# EAGLE design mcu_brd (EAGLE 7.7.0)
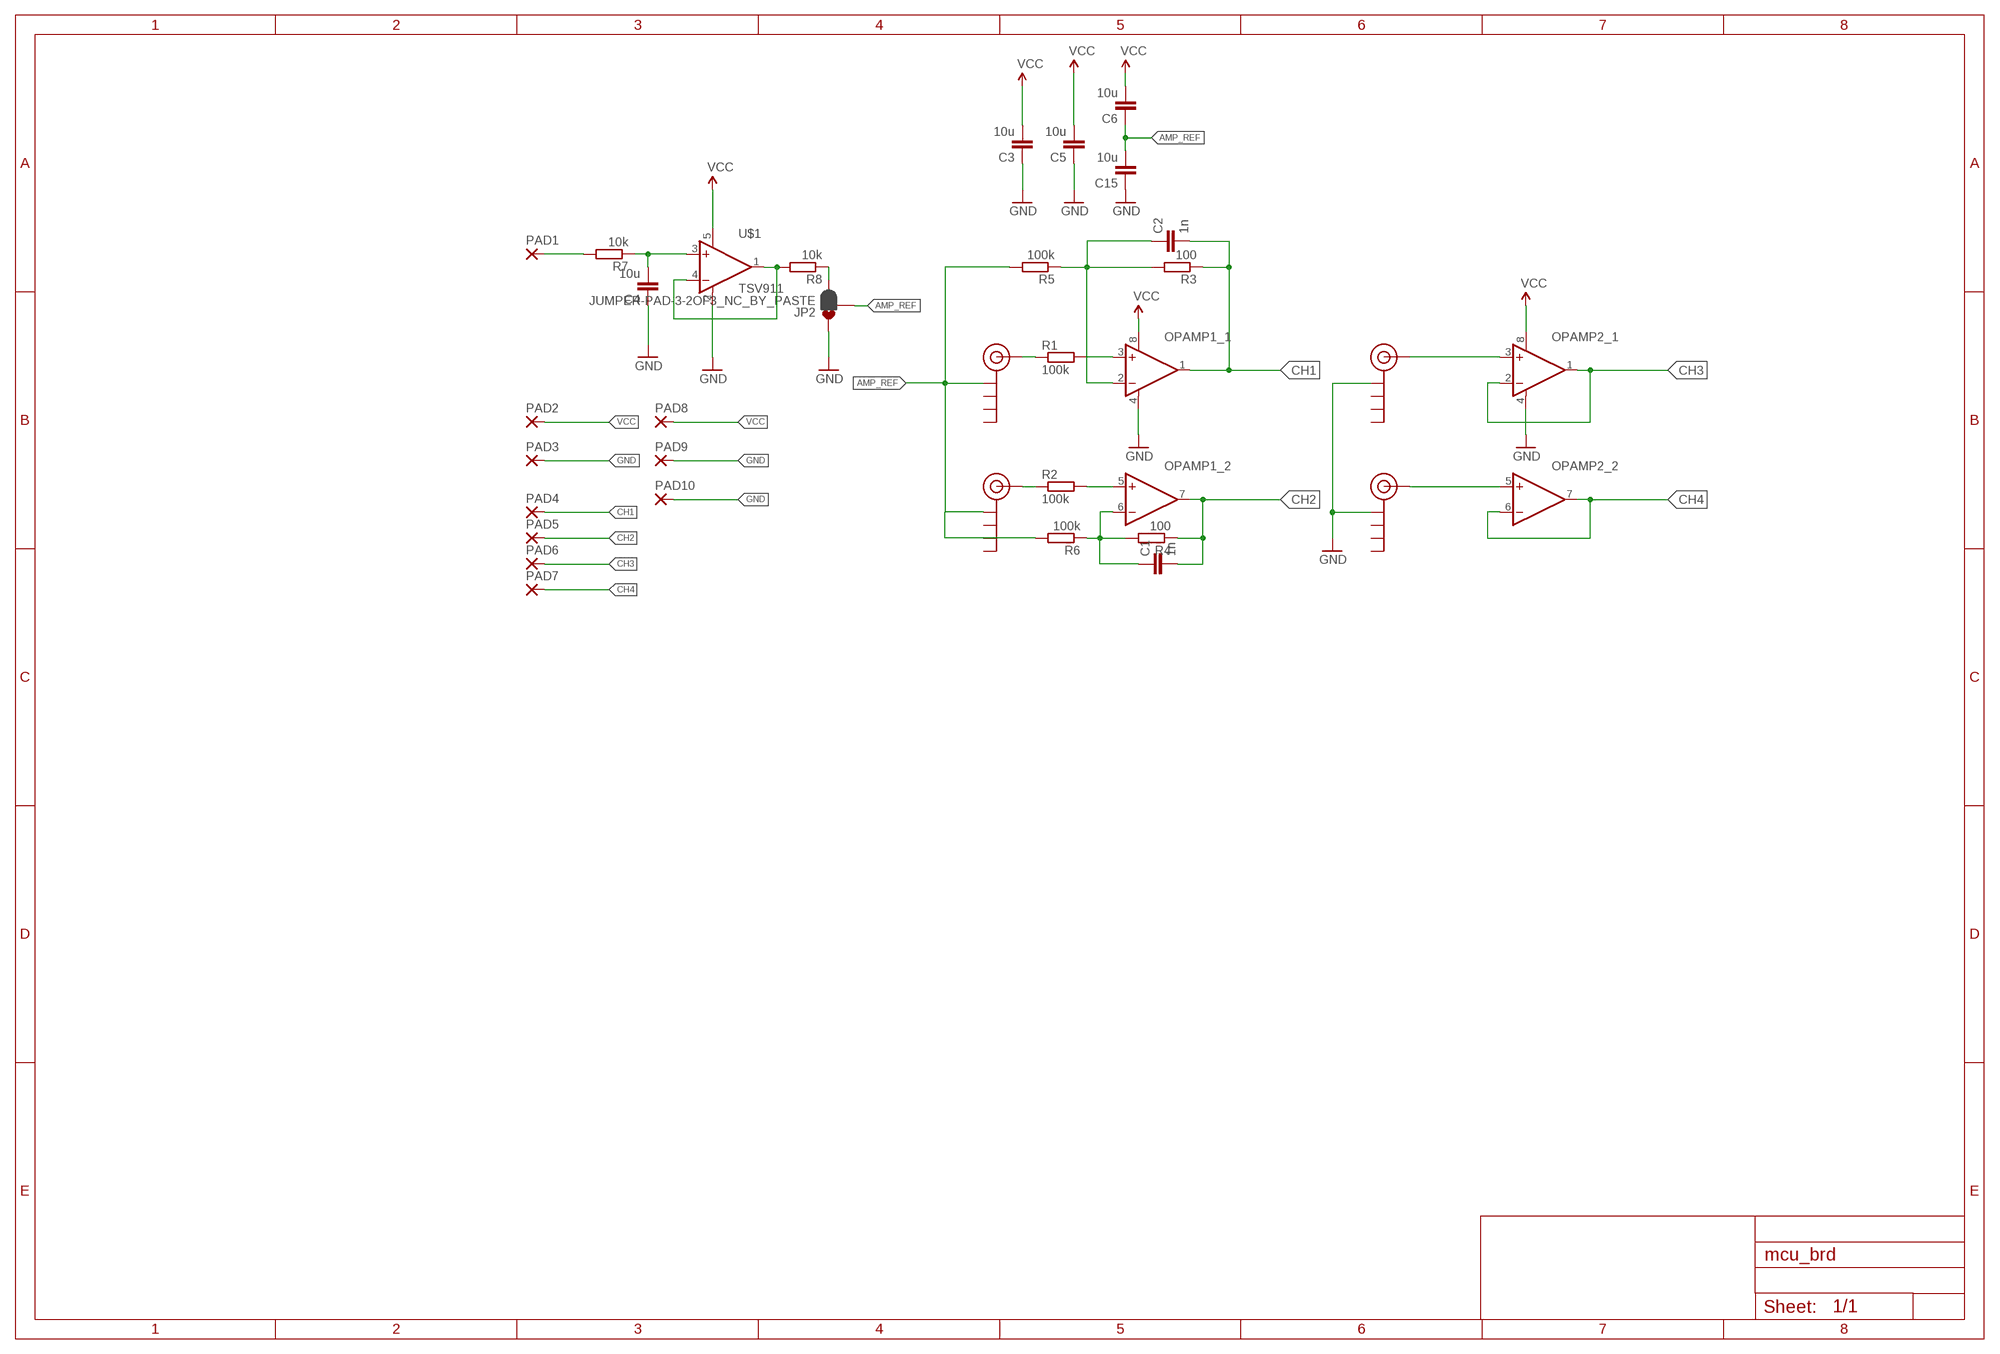
[diagram p0: schematic, sheet 1]

## Parts
C1  1n  CC0603  [C0603]
C2  1n  CC0603  [C0603]
C3  10u  CC0805  [C0805]
C4  10u  CC0805  [C0805]
C5  10u  CC0805  [C0805]
C6  10u  CC0805  [C0805]
C15  10u  CC0805  [C0805]
J$1  SMA_EDGE  [SMA-EDGE]
J$2  SMA_EDGE  [SMA-EDGE]
J$3  SMA_EDGE  [SMA-EDGE]
J$4  SMA_EDGE  [SMA-EDGE]
JP2  JUMPER-PAD-3-2OF3_NC_BY_PASTE  [PAD-JUMPER-3-2OF3_NC_BY_PASTE_YES_SILK_FULL_BOX]
OPAMP1  LMC662  [SO08]
OPAMP2  LMC662  [SO08]
PAD1  SMD2  [SMD1,27-2,54]
PAD2  SMD2  [SMD1,27-2,54]
PAD3  SMD2  [SMD1,27-2,54]
PAD4  SMD2  [SMD1,27-2,54]
PAD5  SMD2  [SMD1,27-2,54]
PAD6  SMD2  [SMD1,27-2,54]
PAD7  SMD2  [SMD1,27-2,54]
PAD8  SMD2  [SMD1,27-2,54]
PAD9  SMD2  [SMD1,27-2,54]
PAD10  SMD2  [SMD1,27-2,54]
R1  100k  R0603  [0603]
R2  100k  R0603  [0603]
R3  100  R0603  [0603]
R4  100  R0603  [0603]
R5  100k  R0603  [0603]
R6  100k  R0603  [0603]
R7  10k  R0603  [0603]
R8  10k  R0603  [0603]
U$1  TSV911  [SOT23-5L]

## Nets
AMP_REF: C6.1 C15.2 J$1.GND@0(GND) J$2.GND@0(GND) JP2.2 R5.2 R6.2
CH1: C2.2 OPAMP1.1(_1:OUT) PAD4.1(P) R3.1
CH2: C1.2 OPAMP1.7(_2:OUT) PAD5.1(P) R4.1
CH3: OPAMP2.1(_1:OUT) OPAMP2.2(_1:-IN) PAD6.1(P)
CH4: OPAMP2.6(_2:-IN) OPAMP2.7(_2:OUT) PAD7.1(P)
GND: C3.1 C4.1 C5.1 C15.1 J$3.GND@0(GND) J$4.GND@0(GND) JP2.1 OPAMP1.4(_1:V-) OPAMP2.4(_1:V-) PAD3.1(P) PAD9.1(P) PAD10.1(P) U$1.2(V-)
N$1: J$2.SIG(SIGNAL) R2.1
N$2: J$1.SIG(SIGNAL) R1.1
N$3: C2.1 OPAMP1.2(_1:-IN) R3.2 R5.1
N$4: C1.1 OPAMP1.6(_2:-IN) R4.2 R6.1
N$5: R8.2 U$1.1(OUT) U$1.4(-IN)
N$6: OPAMP1.3(_1:+IN) R1.2
N$7: OPAMP1.5(_2:+IN) R2.2
N$8: C4.2 R7.1 U$1.3(+IN)
N$9: J$3.SIG(SIGNAL) OPAMP2.3(_1:+IN)
N$10: J$4.SIG(SIGNAL) OPAMP2.5(_2:+IN)
N$11: JP2.3 R8.1
REFIN: PAD1.1(P) R7.2
VCC: C3.2 C5.2 C6.2 OPAMP1.8(_1:V+) OPAMP2.8(_1:V+) PAD2.1(P) PAD8.1(P) U$1.5(V+)
Unconnected: J$1.GND@1(GND) J$1.GND@2(GND) J$1.GND@3(GND) J$2.GND@1(GND) J$2.GND@2(GND) J$2.GND@3(GND) J$3.GND@1(GND) J$3.GND@2(GND) J$3.GND@3(GND) J$4.GND@1(GND) J$4.GND@2(GND) J$4.GND@3(GND)

## Library data of the parts
C1-C6 C15 = smalsmd:C: Capacitor
J$1-J$4 = SparkFun-Connectors:SMA_EDGE: SMA Antenna Connector End launch SMA connector. The paste layer has been removed so that the connector can be hand soldered onto the board after reflow.
JP2 = SparkFun-Passives:JUMPER-PAD-3-2OF3_NC_BY_PASTE
OPAMP1 OPAMP2 = OU:LMC662
PAD1-PAD10 = wirepad:SMD2: SMD PAD
R1-R8 = smalsmd:R
U$1 = OU:TSV911

## Board
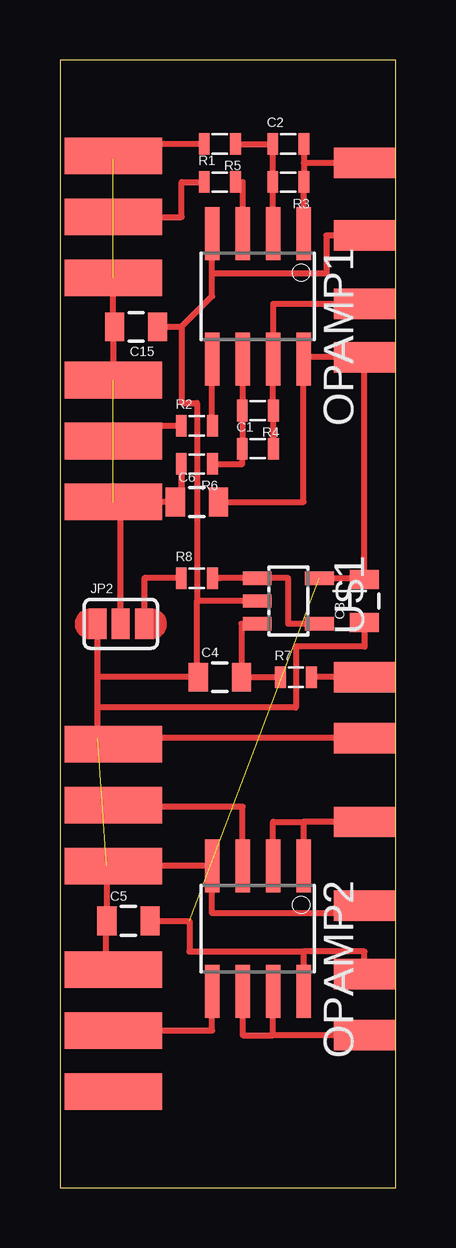
[diagram p1: board, top side]
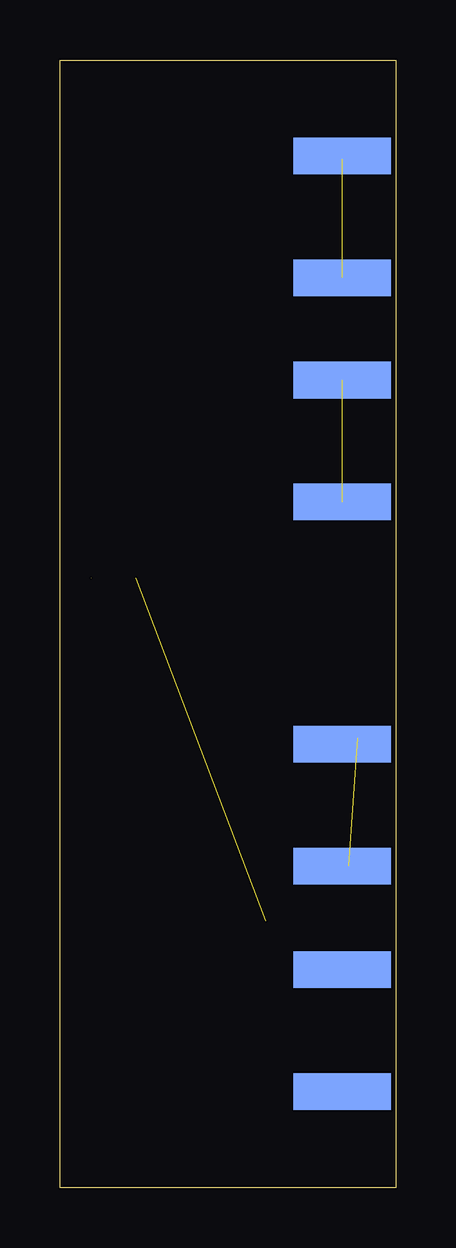
[diagram p2: board, bottom side, seen from below]

Size 14 x 47 mm. Coordinates in mm from the lower left corner, seen from the top.
Outline: 0,0 14,0 14,47 0,47 0,0
Copper layers (1*16): Top 0.035mm / dielectric 1.5mm / Bottom 0.035mm
Design rules "SparkFun": minimum track width 8mil, minimum drill 20mil, track to track 8mil, track to pad 8mil, pad to pad 8mil, via to via 8mil, smd to smd 8mil, copper to edge 10mil, drill to drill 8mil, minimum pad ring 12mil, minimum via ring 10mil, stop-mask expansion 4mil, vias tented up to drill 25mil, thermal gap 10mil

### Footprints (pad centres in the part's own frame; a part is rotated, then mirrored left to right if it is on the bottom)
C0603 = smd 0.45 x 0.9: 1 -0.65,0; 2 0.65,0
C0805 = smd 0.8 x 1.2: 1 -0.9,0; 2 0.9,0
SMA-EDGE = smd 1.524 x 4.064: GND@0 -2.54,0; GND@1 2.54,0; SIG 0,0 | smd 1.524 x 4.064 bottom: GND@2 -2.54,0; GND@3 2.54,0
PAD-JUMPER-3-2OF3_NC_BY_PASTE_YES_SILK_FULL_BOX = smd 0.75 x 1.27: 1 -0.972,0; 2 0,0; 3 0.972,0
SO08 = smd 0.61 x 2.21: 1 -1.905,-2.616; 2 -0.635,-2.616; 3 0.635,-2.616; 4 1.905,-2.616; 5 1.905,2.616; 6 0.635,2.616; 7 -0.635,2.616; 8 -1.905,2.616
SMD1,27-2,54 = smd 1.27 x 2.54: 1 0,0
0603 = smd 0.45 x 0.9: 1 -0.65,0; 2 0.65,0
SOT23-5L = smd 0.55 x 1.2: 1 -0.95,-1.3; 2 0,-1.3; 3 0.95,-1.3; 4 0.95,1.3; 5 -0.95,1.3

### Placement (x,y rotation side)
C1  8.26,30.8 0 top
C2  9.53,43.5 0 top
C3  12.7,24.45 90 top
C4  6.67,21.27 0 top
C5  2.86,11.11 0 top
C6  5.71,28.57 0 top
C15  3.17,35.88 180 top
J$1  2.22,40.46 90 top
J$2  2.22,31.11 90 top
J$3  2.22,15.94 90 top
J$4  2.22,6.54 270 top
JP2  2.54,23.5 0 top
OPAMP1  8.26,37.15 180 top
OPAMP2  8.26,10.79 180 top
PAD1  12.7,21.27 90 top
PAD2  12.7,34.61 90 top
PAD3  12.7,11.75 90 top
PAD4  12.7,42.7 90 top
PAD5  12.7,36.83 90 top
PAD6  12.7,15.24 90 top
PAD7  12.7,6.35 90 top
PAD8  12.7,8.89 90 top
PAD9  12.7,18.73 90 top
PAD10  12.7,39.69 90 top
R1  6.67,41.91 0 top
R2  5.71,31.75 0 top
R3  9.53,41.91 180 top
R4  8.26,32.38 180 top
R5  6.67,43.5 180 top
R6  5.71,30.16 180 top
R7  9.84,21.27 0 top
R8  5.71,25.4 0 top
U$1  9.53,24.45 270 top

### Tracks (layer width: path | path; a pad name or v marks a point on that pad's centre or on a via)
AMP_REF  (2 unrouted)
  Top 0.254: R5.2 2.22,43.5 2.22,42.86 | 2.22,35.88 J$1.GND@0 | JP2.2 2.54,28.57 J$2.GND@0 | 2.22,28.89 J$2.GND@0 | J$2.GND@0 C6.1 5.07,28.57 R6.2 5.08,30.16 5.08,28.57 J$2.GND@0 | C15.2 2.22,35.88 | 2.22,35.88 2.22,33.66
CH1
  Top 0.254: C2.2 10.18,42.7 | 10.18,42.7 R3.1 10.16,42.23 OPAMP1.1 | PAD4.1 10.18,42.7
CH2
  Top 0.254: C1.2 R4.1 8.89,32.38 OPAMP1.7 8.89,36.83 PAD5.1
CH3
  Top 0.254: OPAMP2.2 8.89,15.24 10.16,15.24 | 10.16,15.24 OPAMP2.1 | PAD6.1 10.16,15.24
CH4
  Top 0.254: OPAMP2.6 7.62,6.35 8.89,6.35 | 8.89,6.35 OPAMP2.7 | PAD7.1 8.89,6.35
GND  (1 unrouted)
  Top 0.254: C15.1 5.08,35.88 | 5.08,35.88 6.35,37.15 6.35,38.1 | 6.35,38.1 OPAMP1.4 | J$4.GND@0 2.22,9.53 1.91,9.53 1.91,11.11 C5.1 1.96,13.4 J$3.GND@0 OPAMP2.4 6.35,11.43 12.7,11.43 PAD3.1 | U$1.2 5.71,24.45 | 1.57,21.27 C4.1 5.71,21.27 5.71,24.45 | 5.08,35.88 5.08,32.7 5.71,32.7 5.71,24.45 | C3.1 12.7,22.54 9.84,22.54 9.84,20 1.57,20 | PAD9.1 1.57,18.73 1.57,20 | PAD10.1 11.11,39.69 11.11,38.1 6.35,38.1 | 1.57,20 1.57,21.27 | 1.57,21.27 JP2.1
N$1
  Top 0.254: R2.1 2.22,31.75 J$2.SIG
N$2
  Top 0.254: J$1.SIG 5.08,40.46 5.08,41.91 6,41.91 R1.1
N$3
  Top 0.254: OPAMP1.2 8.88,39.76 R3.2 C2.1 R5.1
N$4
  Top 0.254: OPAMP1.6 7.61,34.53 R4.2 C1.1 7.61,30.16 R6.1
N$5
  Top 0.254: U$1.4 9.53,23.5 9.53,25.4 U$1.1 6.67,25.4 R8.2
N$6
  Top 0.254: R1.2 7.62,41.91 OPAMP1.3
N$7
  Top 0.254: R2.2 6.35,31.75 OPAMP1.5
N$8
  Top 0.254: R7.1 C4.2 7.57,23.5 U$1.3
N$9
  Top 0.254: OPAMP2.3 7.62,15.88 2.22,15.88 J$3.SIG
N$10
  Top 0.254: J$4.SIG 6.35,6.54 OPAMP2.5
N$11
  Top 0.254: R8.1 3.51,25.4 JP2.3
REFIN
  Top 0.254: 10.48,21.27 R7.2 PAD1.1
VCC  (2 unrouted)
  Top 0.254: 12.7,25.4 PAD2.1 10.16,34.61 OPAMP1.8 10.16,28.57 C6.2 | U$1.5 12.7,25.4 C3.2 | C5.2 5.4,11.11 5.4,9.84 10.16,9.84 | 10.16,9.84 OPAMP2.8 | PAD8.1 12.7,9.84 10.16,9.84